# Altium project GPS-M2-ZED-F9T.PrjPcb
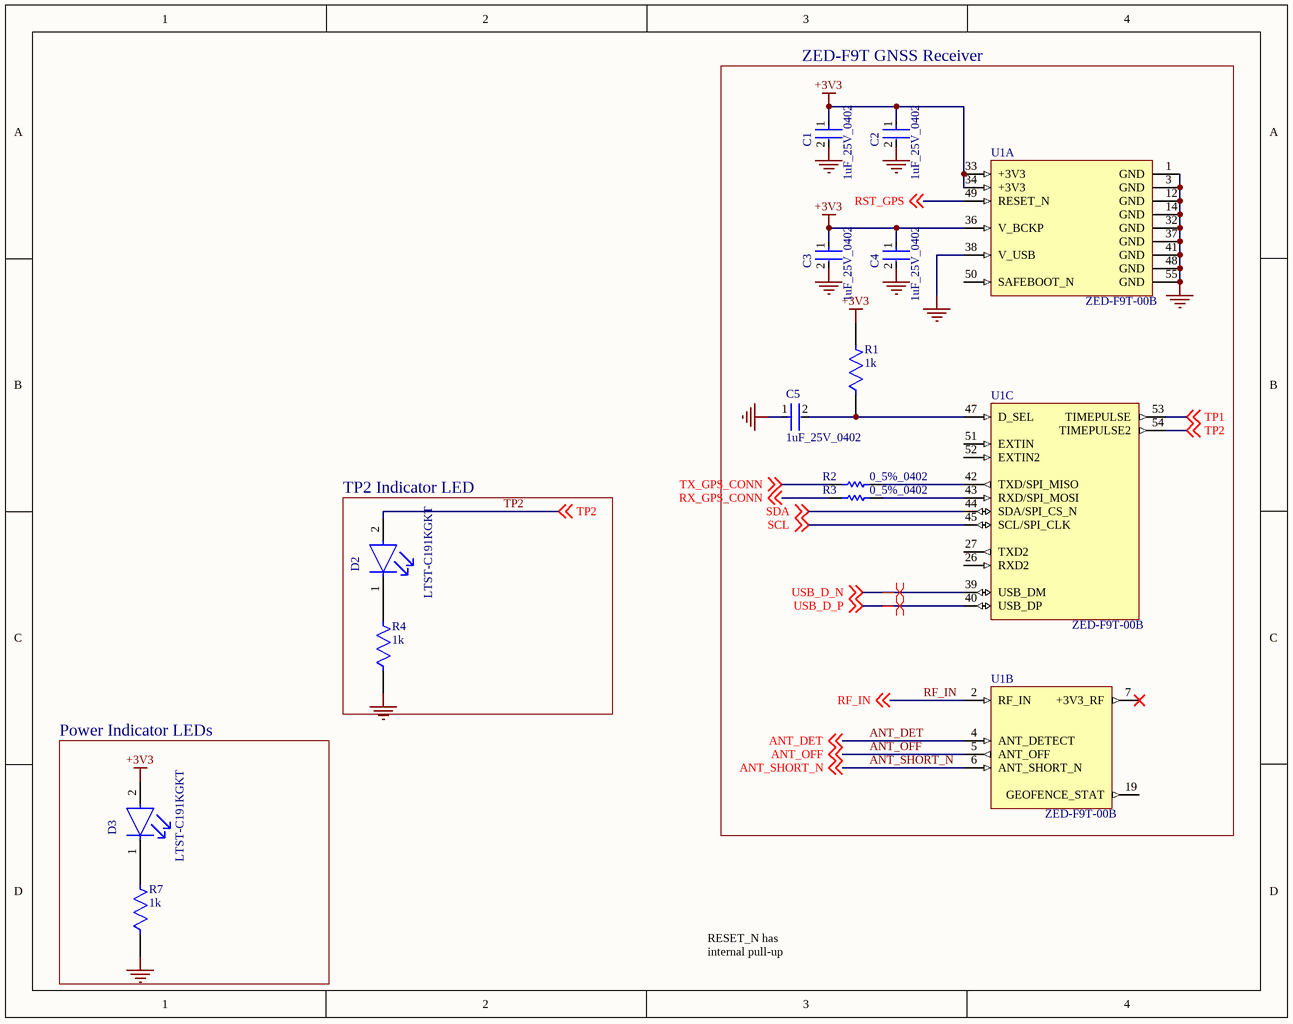
[diagram p0: 01-M2_ZED-F9T_MODULE.SchDoc]
TENSH: ТЕНШ.468157.04; revision: rev.1.0; company: SHIWA NETWORK
2 sheets, 20 parts. Net scope: global (net labels, ports and power ports of the same name join across sheets).
Board file: GPS-M2-ZED-F9T.PcbDoc
Sheets:
  01-M2_ZED-F9T_MODULE.SchDoc
  03-M2_GoldFingers.SchDoc

## Sheet 01-M2_ZED-F9T_MODULE.SchDoc: NOT USED
size A; ApprovedBy: NOT USED; CheckedBy: NOT USED; Author: NOT USED; CompanyName: NOT USED; DrawnBy: NOT USED; Engineer: NOT USED; Organization: NOT USED; Address1: NOT USED; Address2: NOT USED; Address3: NOT USED; Address4: NOT USED; Revision: NOT USED; SheetNumber: 1; SheetTotal: 3; sch_PageDescription: sch_PageDescription; sch_PageTitle: sch_PageTitle; SPICEModelCacheWBLFPAIA: <root> / <DocumentId>WBLFPAIA</DocumentId> / </root>; DocumentFullPathAndName: NOT USED; DocumentName: NOT USED; ImagePath: NOT USED; ProjectName: NOT USED; Application_BuildNumber: NOT USED

### Parts
C1  1uF_25V_0402  [FP-CL542-IPC_C]
C2  1uF_25V_0402  [FP-CL542-IPC_C]
C3  1uF_25V_0402  [FP-CL542-IPC_C]
C4  1uF_25V_0402  [FP-CL542-IPC_C]
C5  1uF_25V_0402  [FP-CL542-IPC_C]
D2  LTST-C191KGKT  [FP-LTST-C191KGKT-MFG]
D3  LTST-C191KGKT  [FP-LTST-C191KGKT-MFG]
R1  1k  [FP-RMCF0402-MFG]
R2  0_5%_0402  [RESC1005X40X25NL05T10]
R3  0_5%_0402  [RESC1005X40X25NL05T10]
R4  1k  [FP-RMCF0402-MFG]
R7  1k  [FP-RMCF0402-MFG]
U1  ZED-F9T-00B  [GPS_ZED-F9T]  (parts A,B,C of 3)

### Blocks framed on the sheet
ZED-F9T GNSS Receiver: C1-C5 R1-R3 U1
TP2 Indicator LED: D2 R4
Power Indicator LEDs: D3 R7

### Nets
+3V3: C1.1 C2.1 C3.1 C4.1 D3.2(A) R1.2 U1.33(+3V3) U1.34(+3V3) U1.36(V_BCKP)
GND: C1.2 C2.2 C3.2 C4.2 C5.1 R4.1 R7.1 U1.1(GND) U1.3(GND) U1.12(GND) U1.14(GND) U1.32(GND) U1.37(GND) U1.38(V_USB) U1.41(GND) U1.48(GND) U1.55(GND)
ANT_DET: U1.4(ANT_DETECT) ; off-sheet ANT_DET
ANT_OFF: U1.5(ANT_OFF) ; off-sheet ANT_OFF
ANT_SHORT_N: U1.6(ANT_SHORT_N) ; off-sheet ANT_SHORT_N
RF_IN: U1.2(RF_IN) ; off-sheet RF_IN
RST_GPS: U1.49(RESET_N) ; off-sheet RST_GPS
RX_GPS_CONN: R3.1 ; off-sheet RX_GPS_CONN
SCL: U1.45(SCL/SPI_CLK) ; off-sheet SCL
SDA: U1.44(SDA/SPI_CS_N) ; off-sheet SDA
TP1: U1.53(TIMEPULSE) ; off-sheet TP1
TP2: D2.2(A) U1.54(TIMEPULSE2) ; off-sheet TP2
TX_GPS_CONN: R2.1 ; off-sheet TX_GPS_CONN
USB_D_N: U1.39(USB_DM) ; off-sheet USB_D_N
USB_D_P: U1.40(USB_DP) ; off-sheet USB_D_P
NetC5_2: C5.2 R1.1 U1.47(D_SEL)
NetD2_1: D2.1(C) R4.2
NetD3_1: D3.1(C) R7.2
NetR2_2: R2.2 U1.42(TXD/SPI_MISO)
NetR3_2: R3.2 U1.43(RXD/SPI_MOSI)

Not connected (* = marked no-connect by the designer): U1 7(+3V3_RF)* 19(GEOFENCE_STAT) 26(RXD2) 27(TXD2) 50(SAFEBOOT_N) 51(EXTIN) 52(EXTIN2)

### Layout directives
differential pair: USB_D_N, USB_D_P

### Notes on the sheet
- RESET_N has internal pull-up
- CONFIDENTIALITY NOTICE
- TITLE
- PROJECT
- ENGINEER
- FILENAME
- GENERATED DATE
- DESCRIPTION
- SCHEMATIC NUMBER
- REV
- SHEET
- THIS DOCUMENT IS CONFIDENTIAL AND CONTAINS DESIGNS AND OTHER PROPRIETARY INFORMATION OF META PLATFORMS TECHNOLOGIES, LLC AND ITS AFFILIATES. THIS DOCUMENT AND THE INFORMATION IT CONTAINS MAY NOT BE DUPLICATED, DISCLOSED OR USED, IN WHOLE OR IN PART, FOR ANY PURPOSE (INCLUDING MANUFACTURE OF ANY COMPONENT) WITHOUT THE PRIOR WRITTEN CONSENT OF META PLATFORMS TECHNOLOGIES, LLC.

### Library data of the parts
C1-C5 = CMP-13271-001051-1: Cap Ceramic 1uF 25V X5R ±10% SMD 0402 +85°C Paper T/R; Radiation Hardening: No; Lead Free: Lead Free; Capacitance: 1uF; Package Quantity: 10000; Max Operating Temperature: 85°C; Voltage Rating: 25V; Case/Package: 0402; Min Operating Temperature: -55°C; Packaging: Tape and Reel; Tolerance: 10%; Height: 0.5mm; Thickness: 0.022inch; Case Code (Metric): 1005; Width: 0.02inch; Case Code (Imperial): 0402; Dielectric: X5R; Length: 1mm; Mount: Surface Mount; Material: Ceramic; Depth: 0.5mm
D2 D3 = CMP-2000-05198-2: LED GREEN CLEAR SMD; Max Power Dissipation: 75mW; Forward Current: 30mA; Reverse Voltage: 5V; Lens Color: Colorless; Forward Voltage: 2V; Dominant Wavelength: 571nm; Number of LEDs: 1; Viewing Angle: 130°; Lens Style: Rectangular; Test Current: 20mA; Luminous Intensity: 35mcd; Wavelength: 574nm; Width: 0.8mm; Case Code (Imperial): 0603; Number of Pins: 2; Lead Free: Lead Free; Packaging: Tape and Reel; Package Quantity: 1; Min Operating Temperature: -55°C; Case/Package: 0603; Length: 1.6mm; Power Dissipation: 75mW; Depth: 0.8mm; Radiation Hardening: No; Mount: Surface Mount; Max Operating Temperature: 85°C; Color: Green; Power Rating: 75mW; Height: 0.55mm; Illumination Color: Green; Case Code (Metric): 1608; Lens Transparency: Clear; Number of Elements: 1
R1 R4 R7 = CMP-26527-000026-1: 1kΩ ±1% 0.063W 0402 Thick Film Chip Resistor AEC-Q200 compliant; Resistance: 1kR; Temperature Coefficient: 100ppm/°C; Power Rating: 63mW; Length: 1mm; RoHS Compliant: Yes; Construction: Rectangular; Height: 0.016inch; Size Code: 0402; Lead Free: Lead Free; Radiation Hardening: No; Tolerance: 1%; Width: 0.02inch; Military Standard: Not; Resistor Type: Thick Film; Number of Terminations: 2; Min Operating Temperature: -55°C; Max Operating Temperature: 155°C; Depth: 0.5mm; Features: Automotive AEC-Q200; Packaging: Tape and Reel; Case Code (Metric): 1005; Mount: Surface Mount; Contact Plating: Tin; Max Power Dissipation: 63mW; Case/Package: 0402; Case Code (Imperial): 0402; Series: RMCF
R2 R3 = CMP-2002-06457-1: Manufacturer: Panasonic; Part Number: ERJ-U020R00X
U1 = GPS_ZED-F9T: Multi-band GNSS Receiver with Nanosecond-level Timing Accuracy; Manufacturer: u-blox; Interface: I2C,SPI,USB,UART; Sensitivity: -166dBm; Supplier 1: Digi-Key; Manufacturer Part Number: ZED-F9T-00B; RoHS: Yes; Category: RF Receivers, Transceivers; Stock 1: 826; Pricing 1: 1=199.00000, 10=198.80000, 50=180.89020 (USD); Case/Package: SMD/SMT; Min Operating Temperature: -40°C; Max Operating Temperature: 85°C; Packaging: Tape and Reel; ComponentLink1URL: https://www.u-blox.com/sites/default/files/ZED-F9T_ProductSummary_%28UBX-18011626%29.pdf?src-supplier=Digi-Key; ComponentLink1Description: https://www.u-blox.com/sites/default/files/ZED-F9T_ProductSummary_%28UBX-18011626%29.pdf?src-supplier=Digi-Key; Supplier Part Number 1: 672-1197-1-ND

## Sheet 03-M2_GoldFingers.SchDoc
size B; SheetNumber: 3; SheetTotal: 3
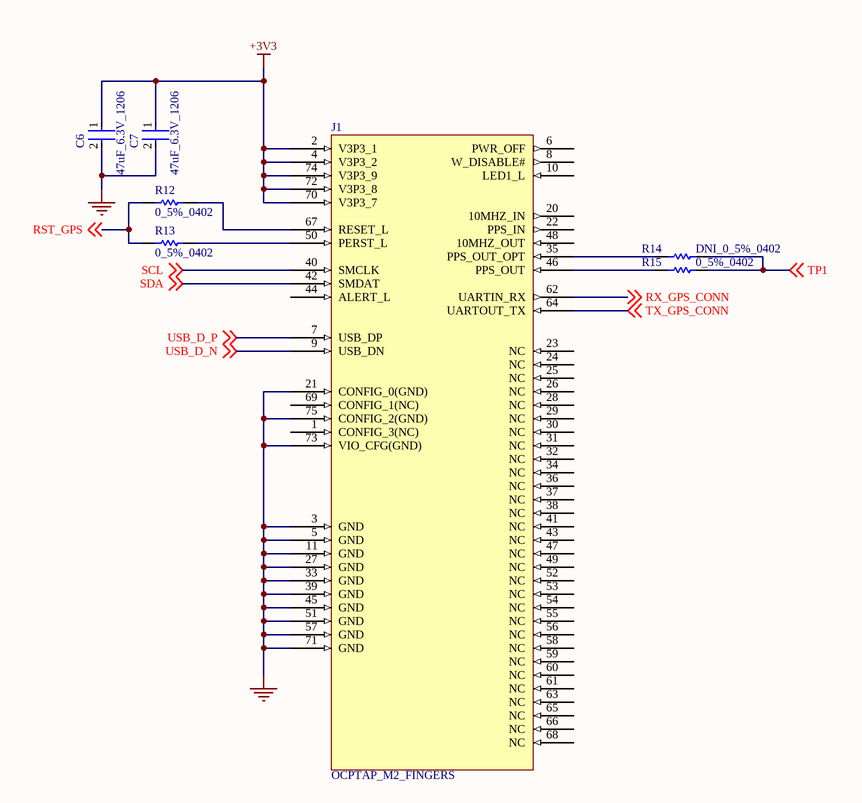
[diagram p1: 03-M2_GoldFingers.SchDoc]

### Parts
C6  47uF_6.3V_1206  [FP-GRM31C-0_2-e0_3_0_8-IPC_C]
C7  47uF_6.3V_1206  [FP-GRM31C-0_2-e0_3_0_8-IPC_C]
J1  OCPTAP_M2_FINGERS  [OCPTAP M2 FINGERS]  (no BOM)
R12  0_5%_0402  [RESC1005X40X25NL05T10]
R13  0_5%_0402  [RESC1005X40X25NL05T10]
R14  DNI_0_5%_0402  [RESC1005X40X25NL05T10]  (no BOM)
R15  0_5%_0402  [RESC1005X40X25NL05T10]

### Nets
+3V3: C6.1 C7.1 J1.2(V3P3_1) J1.4(V3P3_2) J1.70(V3P3_7) J1.72(V3P3_8) J1.74(V3P3_9)
GND: C6.2 C7.2 J1.3(GND) J1.5(GND) J1.11(GND) J1.21(CONFIG_0(GND)) J1.27(GND) J1.33(GND) J1.39(GND) J1.45(GND) J1.51(GND) J1.57(GND) J1.71(GND) J1.73(VIO_CFG(GND)) J1.75(CONFIG_2(GND))
RST_GPS: R12.1 R13.1 ; off-sheet RST_GPS
RX_GPS_CONN: J1.62(UARTIN_RX) ; off-sheet RX_GPS_CONN
SCL: J1.40(SMCLK) ; off-sheet SCL
SDA: J1.42(SMDAT) ; off-sheet SDA
TP1: R14.2 R15.2 ; off-sheet TP1
TX_GPS_CONN: J1.64(UARTOUT_TX) ; off-sheet TX_GPS_CONN
USB_D_N: J1.9(USB_DN) ; off-sheet USB_D_N
USB_D_P: J1.7(USB_DP) ; off-sheet USB_D_P
NetJ1_35: J1.35(PPS_OUT_OPT) R14.1
NetJ1_46: J1.46(PPS_OUT) R15.1
NetJ1_50: J1.50(PERST_L) R13.2
NetJ1_67: J1.67(RESET_L) R12.2

Not connected (* = marked no-connect by the designer): J1 1(CONFIG_3(NC)) 6(PWR_OFF) 8(W_DISABLE#) 10(LED1_L) 20(10MHZ_IN) 22(PPS_IN) 23(NC) 24(NC) 25(NC) 26(NC) 28(NC) 29(NC) 30(NC) 31(NC) 32(NC) 34(NC) 36(NC) 37(NC) 38(NC) 41(NC) 43(NC) 44(ALERT_L) 47(NC) 48(10MHZ_OUT) 49(NC) 52(NC) 53(NC) 54(NC) 55(NC) 56(NC) 58(NC) 59(NC) 60(NC) 61(NC) 63(NC) 65(NC) 66(NC) 68(NC) 69(CONFIG_1(NC))

### Library data of the parts
C6 C7 = CMP-2000-06344-2: Chip Multilayer Ceramic Capacitors for General Purpose, 1206, 47uF, X5R, 15%, 20%, 6.3V; Package Quantity: 2000; Mount: Surface Mount; Length: 3.2mm; Thickness: 0.071inch; Lead Free: Lead Free; Tolerance: 20%; Width: 0.063inch; Depth: 1.6mm; Case/Package: 1206; Dielectric: X5R; Radiation Hardening: No; Packaging: Tape and Reel; Voltage Rating (DC): 6.3V; Termination: SMD/SMT; Height: 1.6mm; Max Operating Temperature: 85°C; Case Code (Metric): 3216; Case Code (Imperial): 1206; Voltage: 6.3V; Voltage Rating: 6.3V; Capacitance: 47uF; Min Operating Temperature: -55°C; Material: Ceramic; REACH SVHC: No SVHC
R12-R15 = CMP-2002-06457-1: as R2 on sheet 01-M2_ZED-F9T_MODULE

## Nets that join several sheets
+3V3: 01-M2_ZED-F9T_MODULE (9 pins), 03-M2_GoldFingers (7 pins)
GND: 01-M2_ZED-F9T_MODULE (17 pins), 03-M2_GoldFingers (15 pins)
RST_GPS: 01-M2_ZED-F9T_MODULE (U1.49), 03-M2_GoldFingers (R12.1 R13.1)
RX_GPS_CONN: 01-M2_ZED-F9T_MODULE (R3.1), 03-M2_GoldFingers (J1.62)
SCL: 01-M2_ZED-F9T_MODULE (U1.45), 03-M2_GoldFingers (J1.40)
SDA: 01-M2_ZED-F9T_MODULE (U1.44), 03-M2_GoldFingers (J1.42)
TP1: 01-M2_ZED-F9T_MODULE (U1.53), 03-M2_GoldFingers (R14.2 R15.2)
TX_GPS_CONN: 01-M2_ZED-F9T_MODULE (R2.1), 03-M2_GoldFingers (J1.64)
USB_D_N: 01-M2_ZED-F9T_MODULE (U1.39), 03-M2_GoldFingers (J1.9)
USB_D_P: 01-M2_ZED-F9T_MODULE (U1.40), 03-M2_GoldFingers (J1.7)

## Assembly variants
revision: not fitted R9 R10